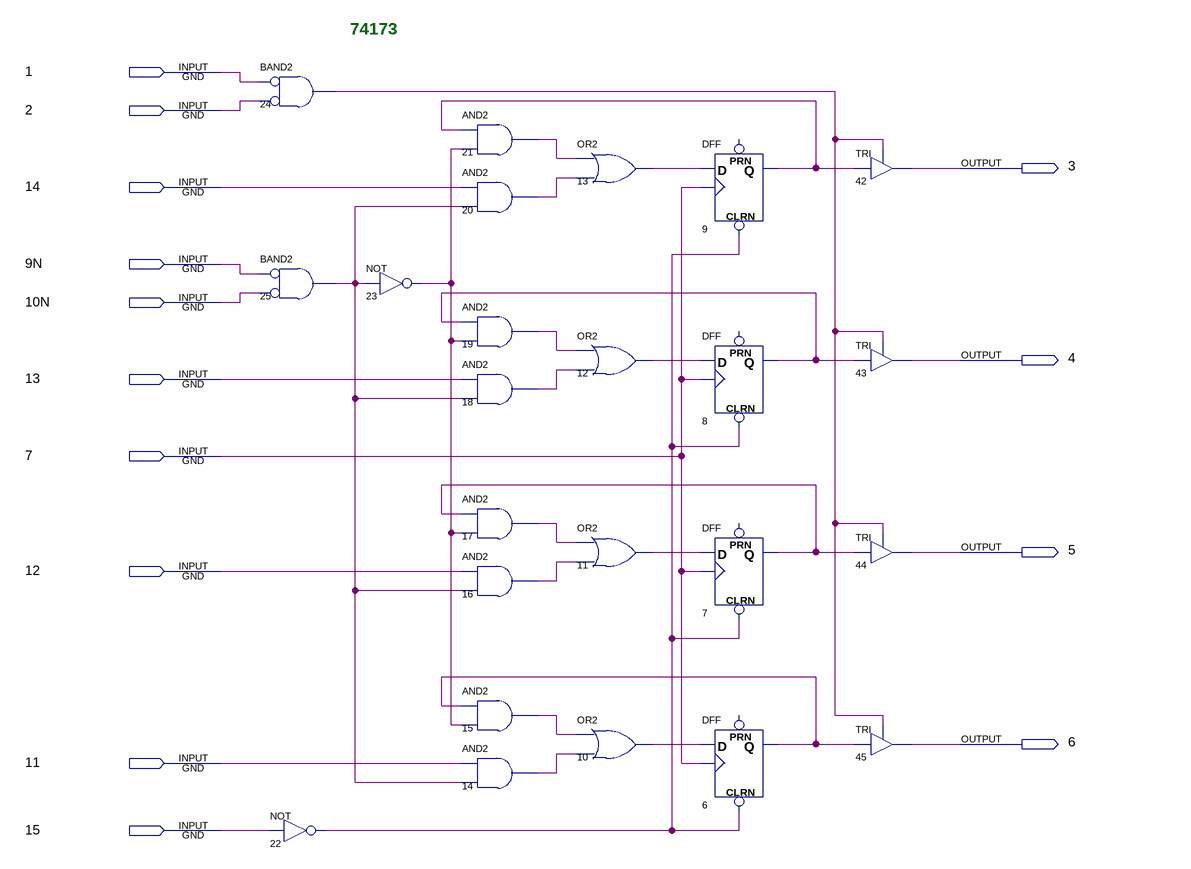
[diagram p0: schematic sheet]
// Quartus schematic 74LS173.bdf as structural Verilog: 24 symbols, 14 pins
module \74LS173  (
  input  \1 ,
  input  \2 ,
  input  \14 ,
  input  \9N ,
  input  \10N ,
  input  \13 ,
  input  \7 ,
  input  \12 ,
  input  \11 ,
  input  \15 ,
  output \3 ,
  output \4 ,
  output \5 ,
  output \6 
);

  wire n6_q, n7_q, n8_q, n9_q, n10_out, n11_out, n12_out, n13_out, n14_out, n15_out, n16_out, n17_out,
       n18_out, n19_out, n20_out, n21_out, n22_out, n23_out, n24_out, n25_out;

  and u_24 (n24_out, ~\1 , ~\2 );  // BAND2
  and u_25 (n25_out, ~\9N , ~\10N );  // BAND2
  not u_22 (n22_out, \15 );
  not u_23 (n23_out, n25_out);
  and u_21 (n21_out, n9_q, n23_out);
  and u_20 (n20_out, \14 , n25_out);
  and u_19 (n19_out, n8_q, n23_out);
  and u_18 (n18_out, \13 , n25_out);
  and u_17 (n17_out, n7_q, n23_out);
  and u_16 (n16_out, \12 , n25_out);
  and u_15 (n15_out, n6_q, n23_out);
  and u_14 (n14_out, \11 , n25_out);
  or u_13 (n13_out, n21_out, n20_out);
  or u_12 (n12_out, n19_out, n18_out);
  or u_11 (n11_out, n17_out, n16_out);
  or u_10 (n10_out, n15_out, n14_out);
  DFF u_9 (.CLRN(n22_out), .CLK(\7 ), .D(n13_out), .Q(n9_q));  // open: PRN
  DFF u_8 (.CLRN(n22_out), .CLK(\7 ), .D(n12_out), .Q(n8_q));  // open: PRN
  DFF u_7 (.CLRN(n22_out), .CLK(\7 ), .D(n11_out), .Q(n7_q));  // open: PRN
  DFF u_6 (.CLRN(n22_out), .CLK(\7 ), .D(n10_out), .Q(n6_q));  // open: PRN
  TRI u_42 (.IN(n9_q), .OE(n24_out), .OUT(\3 ));
  TRI u_43 (.IN(n8_q), .OE(n24_out), .OUT(\4 ));
  TRI u_44 (.IN(n7_q), .OE(n24_out), .OUT(\5 ));
  TRI u_45 (.IN(n6_q), .OE(n24_out), .OUT(\6 ));

  // Notes on the sheet:
  //   74173
endmodule
